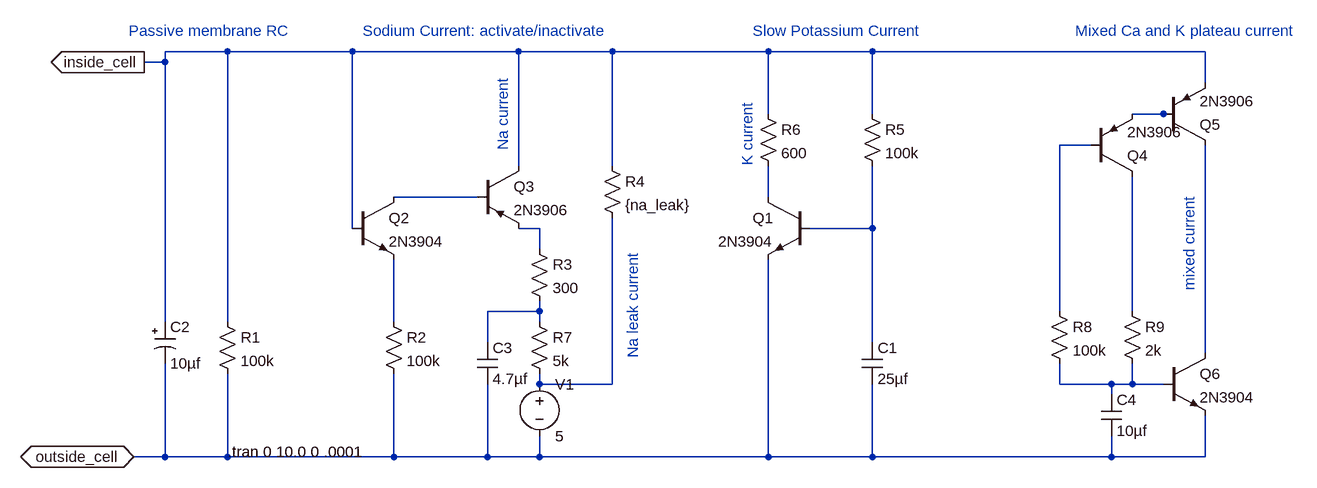
[diagram p0: schematic heart_cell_module.asc]
heart_cell_module.asc, the LTspice schematic file:
Version 4.1
SHEET 1 2184 696
WIRE 176 0 80 0
WIRE 368 0 176 0
WIRE 624 0 368 0
WIRE 768 0 624 0
WIRE 1008 0 768 0
WIRE 1168 0 1008 0
WIRE 1680 0 1168 0
WIRE 80 16 80 0
WIRE 80 16 48 16
WIRE 1680 48 1680 0
WIRE 1008 96 1008 0
WIRE 1168 96 1168 0
WIRE 1616 96 1568 96
WIRE 1632 96 1616 96
WIRE 1504 144 1456 144
WIRE 624 176 624 0
WIRE 768 176 768 0
WIRE 560 224 432 224
WIRE 1008 224 1008 176
WIRE 368 272 368 0
WIRE 656 272 624 272
WIRE 1168 272 1168 176
WIRE 1168 272 1072 272
WIRE 656 304 656 272
WIRE 656 400 656 384
WIRE 656 400 576 400
WIRE 1456 400 1456 144
WIRE 1568 400 1568 192
WIRE 80 416 80 16
WIRE 176 416 176 0
WIRE 432 416 432 320
WIRE 656 416 656 400
WIRE 576 448 576 400
WIRE 1168 448 1168 272
WIRE 1680 464 1680 144
WIRE 656 512 656 496
WIRE 768 512 768 256
WIRE 768 512 656 512
WIRE 1456 512 1456 480
WIRE 1536 512 1456 512
WIRE 1568 512 1568 480
WIRE 1568 512 1536 512
WIRE 1616 512 1568 512
WIRE 1536 528 1536 512
WIRE 80 624 80 480
WIRE 80 624 32 624
WIRE 176 624 176 496
WIRE 176 624 80 624
WIRE 432 624 432 496
WIRE 432 624 176 624
WIRE 576 624 576 512
WIRE 576 624 432 624
WIRE 656 624 656 592
WIRE 656 624 576 624
WIRE 1008 624 1008 320
WIRE 1008 624 656 624
WIRE 1168 624 1168 512
WIRE 1168 624 1008 624
WIRE 1536 624 1536 592
WIRE 1536 624 1168 624
WIRE 1680 624 1680 560
WIRE 1680 624 1536 624
FLAG 48 16 inside_cell
IOPIN 48 16 Out
FLAG 32 624 outside_cell
IOPIN 32 624 BiDir
SYMBOL npn 1072 224 M0
SYMATTR InstName Q1
SYMATTR Value 2N3904
SYMBOL npn 368 224 R0
SYMATTR InstName Q2
SYMATTR Value 2N3904
SYMBOL pnp2 560 176 R0
SYMATTR InstName Q3
SYMATTR Value 2N3906
SYMBOL cap 1152 448 R0
SYMATTR InstName C1
SYMATTR Value 25µf
SYMATTR SpiceLine V=10 Irms=0 Rser=0.009 Lser=0
SYMBOL polcap 64 416 R0
WINDOW 3 24 64 Left 0
SYMATTR Value 10µf
SYMATTR InstName C2
SYMATTR Description Capacitor
SYMATTR Type cap
SYMATTR SpiceLine V=50 Irms=22m Rser=3.9 Lser=0
SYMBOL res 160 400 R0
SYMATTR InstName R1
SYMATTR Value 100k
SYMBOL res 416 400 R0
SYMATTR InstName R2
SYMATTR Value 100k
SYMBOL res 640 288 R0
SYMATTR InstName R3
SYMATTR Value 300
SYMBOL voltage 656 496 R0
WINDOW 123 0 0 Left 0
WINDOW 39 0 0 Left 0
SYMATTR InstName V1
SYMATTR Value 5
SYMBOL res 752 160 R0
SYMATTR InstName R4
SYMATTR Value {na_leak}
SYMBOL res 1152 80 R0
SYMATTR InstName R5
SYMATTR Value 100k
SYMBOL res 992 80 R0
SYMATTR InstName R6
SYMATTR Value 600
SYMBOL res 640 400 R0
SYMATTR InstName R7
SYMATTR Value 5k
SYMBOL cap 560 448 R0
SYMATTR InstName C3
SYMATTR Value 4.7µf
SYMBOL npn 1616 464 R0
SYMATTR InstName Q6
SYMATTR Value 2N3904
SYMBOL cap 1520 528 R0
SYMATTR InstName C4
SYMATTR Value 10µf
SYMBOL res 1440 384 R0
SYMATTR InstName R8
SYMATTR Value 100k
SYMBOL res 1552 384 R0
SYMATTR InstName R9
SYMATTR Value 2k
SYMBOL pnp 1504 192 M180
SYMATTR InstName Q4
SYMATTR Value 2N3906
SYMBOL pnp 1616 144 M180
SYMATTR InstName Q5
SYMATTR Value 2N3906
TEXT 176 616 Left 0 !.tran 0 10.0 0 .0001
TEXT 384 -32 Left 0 ;Sodium Current: activate/inactivate
TEXT 984 -32 Left 0 ;Slow Potassium Current
TEXT 24 -32 Left 0 ;Passive membrane RC
TEXT 1480 -32 Left 0 ;Mixed Ca and K plateau current
TEXT 976 176 VLeft 0 ;K current
TEXT 600 152 VLeft 0 ;Na current
TEXT 1656 368 VLeft 0 ;mixed current
TEXT 800 472 VLeft 0 ;Na leak current

The netlist it stands for:
* heart_cell_module.asc
Q1 N004 N006 outside_cell 0 2N3904
Q2 N003 inside_cell N009 0 2N3904
Q3 inside_cell N003 N005 0 2N3906
C1 N006 outside_cell 25µf V=10 Irms=0 Rser=0.009 Lser=0
C2 inside_cell outside_cell 10µf V=50 Irms=22m Rser=3.9 Lser=0
R1 inside_cell outside_cell 100k
R2 N009 outside_cell 100k
R3 N005 N007 300
V1 N011 outside_cell 5
R4 inside_cell N011 {na_leak}
R5 inside_cell N006 100k
R6 inside_cell N004 600
R7 N007 N011 5k
C3 N007 outside_cell 4.7µf
Q6 N010 N012 outside_cell 0 2N3904
C4 N012 outside_cell 10µf
R8 N002 N012 100k
R9 N008 N012 2k
Q4 N008 N002 N001 0 2N3906
Q5 N010 N001 inside_cell 0 2N3906
.model NPN NPN
.model PNP PNP
.lib standard.bjt
.tran 0 10.0 0 .0001
* Sodium Current: activate/inactivate
* Slow Potassium Current
* Passive membrane RC
* Mixed Ca and K plateau current
* K current
* Na current
* mixed current
* Na leak current
.backanno
.end